# Altium schematic sheet SRAM&Flash.SchDoc: SRAM&Flash
size A3; DocumentNumber: MB1144; Revision: C-02; SheetNumber: 10; SheetTotal: 25; Project: STM32L476G-EVAL; ModifiedDate: 9/23/2015
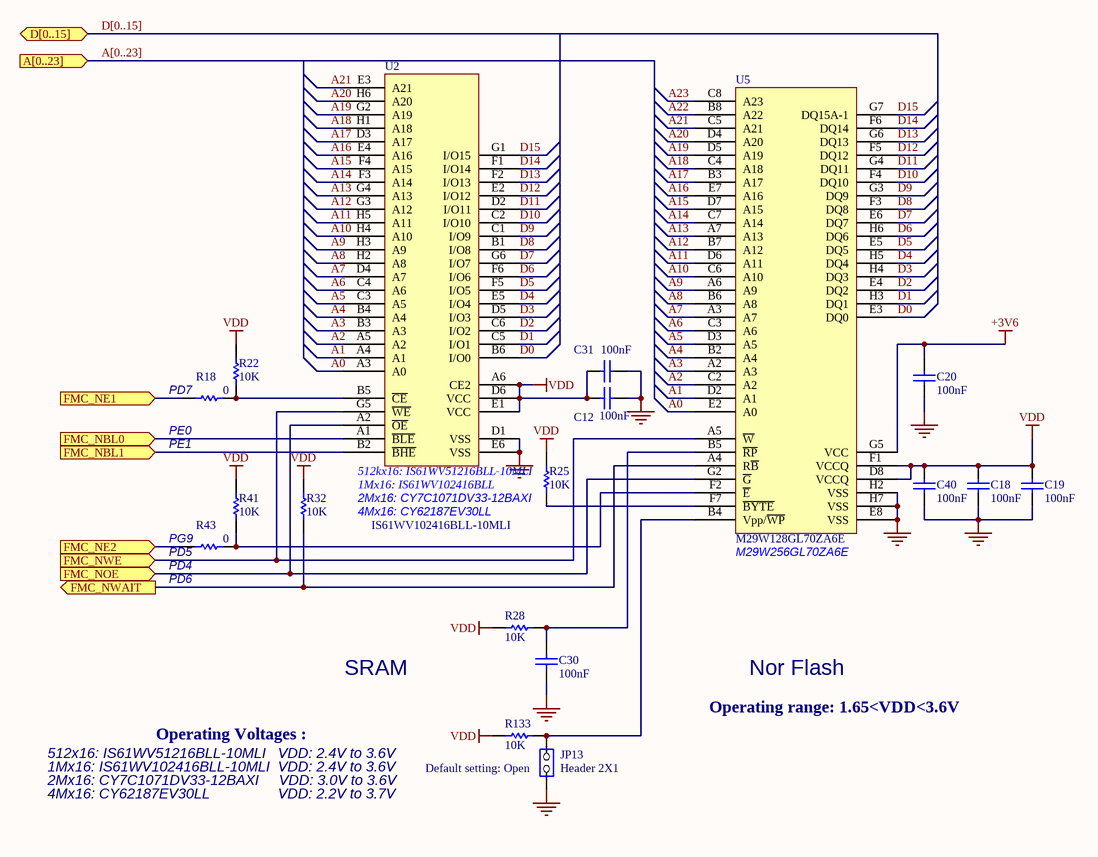
[diagram p0: SRAM&Flash.SchDoc]

## Parts
C12  100nF  [0402C]
C18  100nF  [0402C]
C19  100nF  [0402C]
C20  100nF  [0402C]
C30  100nF  [0402C]
C31  100nF  [0402C]
C40  100nF  [0402C]
JP13  Header 2X1  [SIP2]
R18  0  [0603R]
R22  10K  [0402R]
R25  10K  [0402R]
R28  10K  [0402R]
R32  10K  [0402R]
R41  10K  [0402R]
R43  0  [0603R]
R133  10K  [0402R]
U2  IS61WV102416BLL-10MLI  [BGA48_0R75_9X11]
U5  M29W128GL70ZA6E  [BGA64_1_10X13]

## Ports
A[0..23] (in), D[0..15] (bidir), FMC_NBL0 (in), FMC_NBL1 (in), FMC_NE1 (in), FMC_NE2 (in), FMC_NOE (in), FMC_NWAIT (out), FMC_NWE (in)

## Nets
+3V6: C20.1 U5.G5(VCC)
GND: C12.2 C18.2 C19.2 C20.2 C30.2 C31.2 C40.2 JP13.1(COMMON) U2.D1(VSS) U2.E6(VSS) U5.E8(VSS) U5.H2(VSS) U5.H7(VSS)
VDD: C12.1 C18.1 C19.1 C31.1 C40.1 R22.1 R25.1 R28.1 R32.1 R41.1 R133.1 U2.A6(CE2) U2.D6(VCC) U2.E1(VCC) U5.D8(VCCQ) U5.F1(VCCQ)
A0: U2.A3(A0) U5.E2(A0)
A1: U2.A4(A1) U5.D2(A1)
A2: U2.A5(A2) U5.C2(A2)
A3: U2.B3(A3) U5.A2(A3)
A4: U2.B4(A4) U5.B2(A4)
A5: U2.C3(A5) U5.D3(A5)
A6: U2.C4(A6) U5.C3(A6)
A7: U2.D4(A7) U5.A3(A7)
A8: U2.H2(A8) U5.B6(A8)
A9: U2.H3(A9) U5.A6(A9)
A10: U2.H4(A10) U5.C6(A10)
A11: U2.H5(A11) U5.D6(A11)
A12: U2.G3(A12) U5.B7(A12)
A13: U2.G4(A13) U5.A7(A13)
A14: U2.F3(A14) U5.C7(A14)
A15: U2.F4(A15) U5.D7(A15)
A16: U2.E4(A16) U5.E7(A16)
A17: U2.D3(A17) U5.B3(A17)
A18: U2.H1(A18) U5.C4(A18)
A19: U2.G2(A19) U5.D5(A19)
A20: U2.H6(A20) U5.D4(A20)
A21: U2.E3(A21) U5.C5(A21)
A22: U5.B8(A22)
A23: U5.C8(A23)
D0: U2.B6(I/O0) U5.E3(DQ0)
D1: U2.C5(I/O1) U5.H3(DQ1)
D2: U2.C6(I/O2) U5.E4(DQ2)
D3: U2.D5(I/O3) U5.H4(DQ3)
D4: U2.E5(I/O4) U5.H5(DQ4)
D5: U2.F5(I/O5) U5.E5(DQ5)
D6: U2.F6(I/O6) U5.H6(DQ6)
D7: U2.G6(I/O7) U5.E6(DQ7)
D8: U2.B1(I/O8) U5.F3(DQ8)
D9: U2.C1(I/O9) U5.G3(DQ9)
D10: U2.C2(I/O10) U5.F4(DQ10)
D11: U2.D2(I/O11) U5.G4(DQ11)
D12: U2.E2(I/O12) U5.F5(DQ12)
D13: U2.F2(I/O13) U5.G6(DQ13)
D14: U2.F1(I/O14) U5.F6(DQ14)
D15: U2.G1(I/O15) U5.G7(DQ15A-1)
FMC_NBL0: U2.A1(~{BLE}) ; port FMC_NBL0
FMC_NBL1: U2.B2(~{BHE}) ; port FMC_NBL1
FMC_NE1: R18.2 ; port FMC_NE1
FMC_NE2: R43.2 ; port FMC_NE2
FMC_NOE: U2.A2(~{OE}) U5.G2(~{G}) ; port FMC_NOE
FMC_NWAIT: R32.2 U5.A4(R~{B}) ; port FMC_NWAIT
FMC_NWE: U2.G5(~{WE}) U5.A5(~{W}) ; port FMC_NWE
NetC30_1: C30.1 R28.2 U5.B5(~{RP})
NetJP13_2: JP13.2(NO) R133.2 U5.B4(Vpp/~{WP})
NetR18_1: R18.1 R22.2 U2.B5(~{CE})
NetR25_2: R25.2 U5.F7(~{BYTE})
NetR41_2: R41.2 R43.1 U5.F2(~{E})

## Buses and harness runs
bus A[0..23] = port A[0..23]
bus D[0..15] = port D[0..15]

## Notes on the sheet
- (near R18) PE0
- (near R18) PD7
- PE1
- 2Mx16: CY7C1071DV33-12BAXI
- 512kx16: IS61WV51216BLL-10MLI
- (near U2) 1Mx16: IS61WV102416BLL
- (near R43) PD5
- (near R43) PG9
- (near R43) PD4
- 4Mx16: CY62187EV30LL
- (near U5) M29W256GL70ZA6E
- (near R43) PD6
- SRAM
- Nor Flash
- 512x16: IS61WV51216BLL-10MLI   VDD: 2.4V to 3.6V
- 1Mx16: IS61WV102416BLL-10MLI  VDD: 2.4V to 3.6V
- Operating Voltages :
- (near JP13) Default setting: Open
- Operating range: 1.65<VDD<3.6V
- 2Mx16: CY7C1071DV33-12BAXI     VDD: 3.0V to 3.6V
- 4Mx16: CY62187EV30LL                 VDD: 2.2V to 3.7V
- Title:
- Project:
- Size:
- Date:
- A3
- Reference:
- Sheet:
- Revision:
- of

## Library data of the parts
C12 C18-C20 C30 C31 C40 = Cap: Capacitor; Value: 10nF; Ordered by: Subcon; ECCN_US/EU: NA; Published: 8-Jun-2000; Revision: July-2002: Re-released for DXP Platform.; Publisher: Altium Limited
JP13 = JP2: Ordered by: Subcon; ECCN_US/EU: NA
R18 R43 = Res1: Resistor; Value: 1K; Ordered by: Subcon; ECCN_US/EU: NA; Published: 8-Jun-2000; Revision: July-2002: Re-released for DXP Platform.; Publisher: Altium Limited
R22 R25 R28 R32 R41 R133 = res1: Resistor; Value: 1K; Ordered by: Subcon; ECCN_US/EU: NA; Published: 8-Jun-2000; Revision: July-2002: Re-released for DXP Platform.; Publisher: Altium Limited
U2 = SRAM_4Mx16: Manuf_1: ISSI; Manuf_Part_1: IS61WV102416ALL; Comments: 1Mx16 ISSI SRAM; Ordered by: Subcon; ECCN_US/EU: EAR99/NEC
U5 = M29W128FL70ZA6E: Manuf_1: Micron; Ordered by: Subcon; ECCN_US/EU: 3A991; Manuf_Part_1: M29W128GL70ZA6E